# Altium schematic sheet Debug UART.SchDoc: Debug UART
size 431 x 279 mm; CheckedBy: Lance Bantoto; Engineer: Chealsie Bains; DocumentNumber: 22; Revision: 1; SheetNumber: 22; SheetTotal: 23
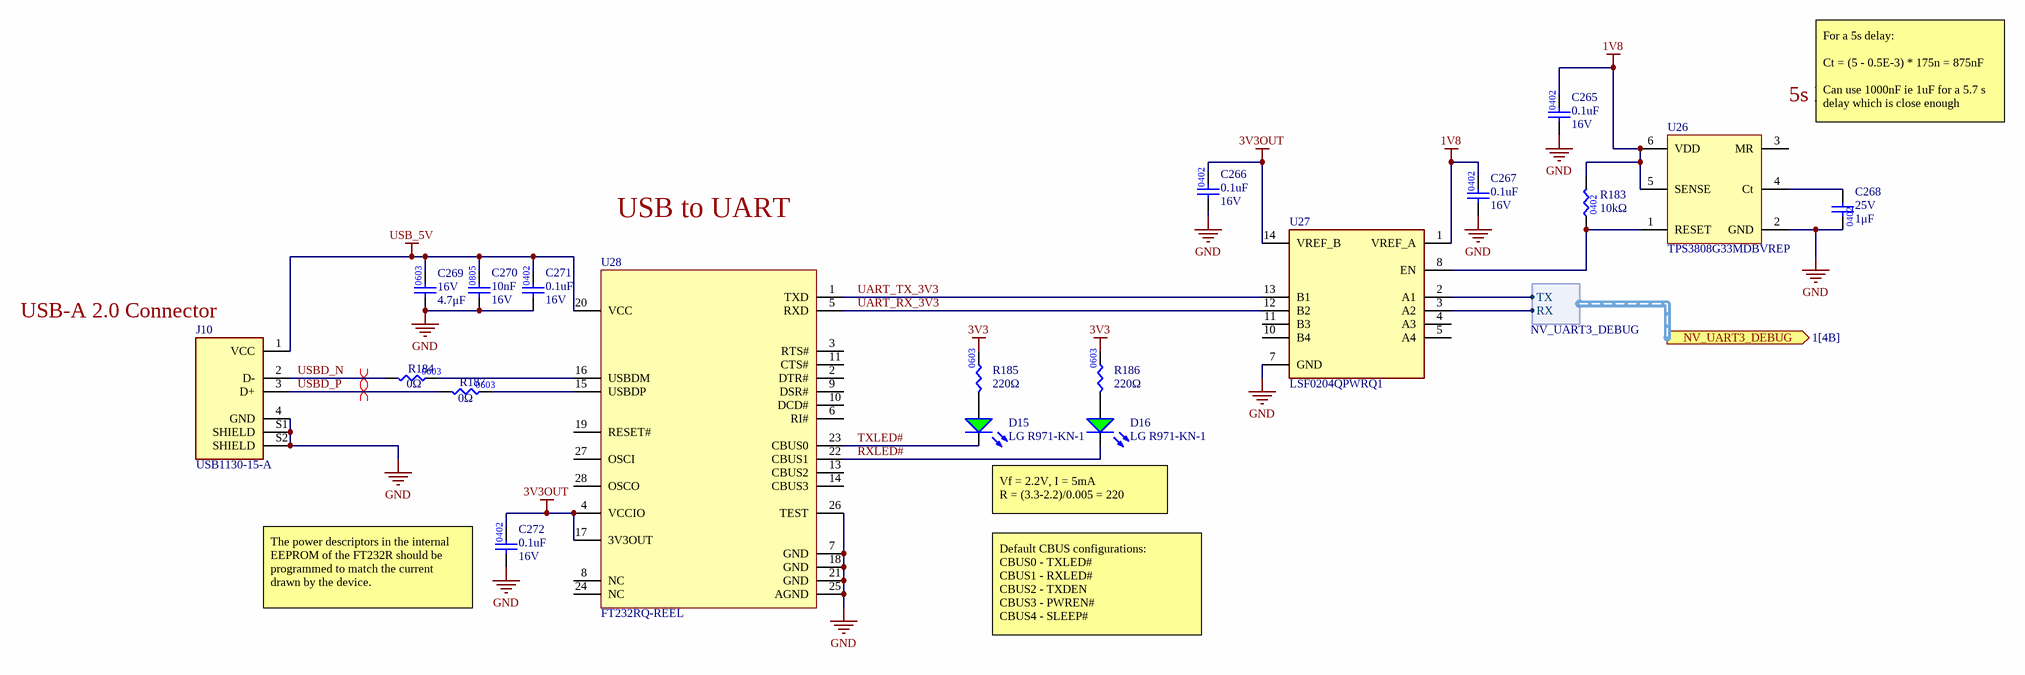
[diagram p0: Debug UART.SchDoc]

## Parts
C265  Capacitance: 0.1uF  Voltage Rating: 16V  [CAP0402]  (hidden comment: CAP_0.1uF_16V_X7R_0402)
C266  Capacitance: 0.1uF  Voltage Rating: 16V  [CAP0402]  (hidden comment: CAP_0.1uF_16V_X7R_0402)
C267  Capacitance: 0.1uF  Voltage Rating: 16V  [CAP0402]  (hidden comment: CAP_0.1uF_16V_X7R_0402)
C268  value 1μF  Voltage: 25V  [CAP0402]  (hidden comment: CAP_1uF_25V_0402)
C269  value 4.7μF  Voltage Rating: 16V  [CAP0603]  (hidden comment: CAP_4.7uF_16V_0603)
C270  value 10nF  Voltage Rating: 16V  [CAP2012]  (hidden comment: CAP_10nF_16V_0805)
C271  Capacitance: 0.1uF  Voltage Rating: 16V  [CAP0402]  (hidden comment: CAP_0.1uF_16V_X7R_0402)
C272  Capacitance: 0.1uF  Voltage Rating: 16V  [CAP0402]  (hidden comment: CAP_0.1uF_16V_X7R_0402)
D15  Manufacturer Part Number 1: LG R971-KN-1  [LED_0805_GREEN]  (hidden comment: LED_GREEN)
D16  Manufacturer Part Number 1: LG R971-KN-1  [LED_0805_GREEN]  (hidden comment: LED_GREEN)
J10  Manufacturer Part Number 1: USB1130-15-A  [USB-A 2.0 Connector]  (hidden comment: USB-A 2.0 Connector)
R183  Resistance: 10kΩ  [RES0402]  (hidden comment: RES_10kΩ_0402_1%)
R184  value 0Ω  [RES0603]  (hidden comment: RES_0Ω_0603)
R185  value 220Ω  [RES0603]  (hidden comment: RES_220Ω_0603)
R186  value 220Ω  [RES0603]  (hidden comment: RES_220Ω_0603)
R187  value 0Ω  [RES0603]  (hidden comment: RES_0Ω_0603)
U26  TPS3808G33MDBVREP  [TPS3808G33MDBVREP]
U27  LSF0204QPWRQ1  [SOP65P640X120-14N]
U28  FT232RQ-REEL  [FT232RQ-REEL_FTD]

## Ports
NV_UART3_DEBUG (out, harness NV_UART3_DEBUG, see 1[4B])

## Harnesses
NV_UART3_DEBUG: RX, TX

## Nets
1V8: C265.2 C267.2 R183.2 U26.5(SENSE) U26.6(VDD) U27.1(VREF_A)
3V3: R185.2 R186.2
3V3OUT: C266.2 C272.2 U27.14(VREF_B) U28.4(VCCIO) U28.17(3V3OUT)
GND: C265.1 C266.1 C267.1 C268.1 C269.1 C270.1 C271.1 C272.1 J10.4(GND) J10.S1(SHIELD) J10.S2(SHIELD) U26.2(GND) U27.7(GND) U28.7(GND) U28.18(GND) U28.21(GND) U28.25(AGND) U28.26(TEST)
USB_5V: C269.2 C270.2 C271.2 J10.1(VCC) U28.20(VCC)
RXLED#: D16.2(K) U28.22(CBUS1)
TXLED#: D15.2(K) U28.23(CBUS0)
UART_RX_3V3: U27.12(B2) U28.5(RXD)
UART_TX_3V3: U27.13(B1) U28.1(TXD)
USBD_N: J10.2(D-) R184.1
USBD_P: J10.3(D+) R187.1
NetC268_2: C268.2 U26.4(Ct)
NetD15_1: D15.1(A) R185.1
NetD16_1: D16.1(A) R186.1
NetR183_1: R183.1 U26.1(RESET) U27.8(EN)
NetR184_2: R184.2 U28.16(USBDM)
NetR187_2: R187.2 U28.15(USBDP)
NetU27_2: U27.2(A1) ; port NV_UART3_DEBUG.TX
NetU27_3: U27.3(A2) ; port NV_UART3_DEBUG.RX

Not connected (* = marked no-connect by the designer): U26 3(MR); U27 4(A3) 5(A4) 10(B4) 11(B3); U28 2(DTR#) 3(RTS#) 6(RI#) 8(NC) 9(DSR#) 10(DCD#) 11(CTS#) 13(CBUS2) 14(CBUS3) 19(RESET#) 24(NC) 27(OSCI) 28(OSCO)

## Layout directives
differential pair: USBD_N, USBD_P

## Notes on the sheet
- (near U26) 5s Delay Buffer
- For a 5s delay:
  Ct = (5 - 0.5E-3) * 175n = 875nF
  Can use 1000nF ie 1uF for a 5.7 s delay which is close enough
- USB to UART
- (near J10) USB-A 2.0 Connector
- Vf = 2.2V, I = 5mA
  R = (3.3-2.2)/0.005 = 220
- (near C272) The power descriptors in the internal EEPROM of the FT232R should be programmed to match the current
  drawn by the device.
- Default CBUS configurations:
  CBUS0 - TXLED#
  CBUS1 - RXLED#
  CBUS2 - TXDEN
  CBUS3 - PWREN#
  CBUS4 - SLEEP#
- University of Waterloo Robotics Team
- 200 University Ave W
- REV
- PROJECT
- Waterloo, Ontario, Canada
- N2L 3G1
- DOCUMENT
- ENGINEER
- REVIEWER
- MODIFIED
- SHEET
- OF
- (in symbol CAP_10nF_16V_0805) 0805

## Library data of the parts
C265-C267 C271 C272 = CAP_0.1uF_16V_X7R_0402: CAP CER 0.1UF 16V X7R 0402; Supplier 1: Digi-Key; Mounting Type: Surface Mount; Package: 0402
C268 = CAP_1uF_25V_0402: CAP CER 1UF 25V X5R 0402; Manufacturer 1: TDK Corporation; Manufacturer Part Number 1: C1005X5R1E105K050BE; Supplier 1: Digi-Key; Supplier Part Number 1: 445-175215-1-ND; Package: 0402
C269 = CAP_4.7uF_16V_0603: CAP CER 4.7UF 16V X6S 0603; Manufacturer Part Number 1: GRM188C81C475KE11D; Manufacturer 1: Murata Electronics; Supplier Part Number 1: 490-13362-1-ND; Supplier 1: Digi-Key; Mounting Type: SMD; Dielectric: X6S; Package: 0603
C270 = CAP_10nF_16V_0805: CAP CER 10000PF 16V X7R 0805; Manufacturer 1: Yageo; Manufacturer Part Number 1: AC0805KRX7R7BB103; Supplier 1: Digi-Key; Supplier Part Number 1: 311-3161-1-ND
D15 D16 = LED_GREEN: LED GREEN DIFFUSED 0805 SMD; Manufacturer 1: OSRAM; Forward Voltage Drop: 2.2V; Package/Footprint: 0805; Supplier Part Number 1: 475-1410-1-ND; Supplier 1: Digi-Key; Mounting Type: SMD
J10 = USB-A 2.0 Connector: USB-A (USB TYPE-A) USB 2.0 Receptacle Connector 4 Position Through Hole, Right Angle; Manufacturer 1: GCT; Supplier 1: Digi-Key; Supplier Part Number 1: 2073-USB1130-15-ACT-ND
R183 = RES_10kΩ_0402_1%: RES 10K OHM 1% 1/16W 0402; Manufacturer Part Number 1: RC1005F103CS; Manufacturer 1: Samsung Electro-Mechanics; Supplier 1: Digi-Key; Supplier Part Number 1: 1276-3431-1-ND; Tolerance: 1%; Package: 0402
R184 R187 = RES_0Ω_0603: RES 0 OHM JUMPER 1/10W 0603; Manufacturer 1: Yageo; Manufacturer Part Number 1: RC0603JR-070RL; Supplier Part Number 1: 311-0.0GRCT-ND; Supplier 1: Digi-Key; Mounting Type: SMD; Package: 0603
R185 R186 = RES_220Ω_0603_5%: RES 220 OHM 5% 1/10W 0603; Manufacturer 1: Yageo; Manufacturer Part Number 1: AC0603JR-07220RL; Package/Footprint: 0603; Supplier Part Number 1: YAG3652CT-ND; Supplier 1: Digi-Key
U26 = TPS3808G33MDBVREP: IC SUPERVISOR 1 CHANNEL SOT23-6; Manufacturer 1: Texas Instruments; Supplier 1: Digi-Key; Supplier Part Number 1: 296-23569-1-ND; Manufacturer Part Number 1: TPS3808G33MDBVREP
U27 = LSF0204QPWRQ1: 4-BITS MULTI-VOLTAGE LEVEL TRANS; Manufacturer 1: Texas Instruments; Channel Type: Bidirectional; Channels per Circuit: 4; Output Type: Open Drain, Push Pull; Data Rate: 100MBd; Voltage - VCCA: 0.8V - 4.5V; Voltage - VCCB: 1.8V - 5.5V; Manufacturer Part Number 1: LSF0204QPWRQ1; Supplier 1: Digi-Key; Supplier Part Number 1: 296-51425-1-ND; Package: 14-TSSOP
U28 = FT232RQ-REEL: USB Bridge, USB to UART USB 2.0 UART Interface 32-QFN (5x5); Manufacturer: FTDI; Max Frequency: 48MHz; Package Equivalence Code: LCC32,.2SQ,20; Max Supply Voltage: 5.25V; Min Supply Voltage: 3.3V; Max Supply Current: 100uA; Qualification Status: Not Qualified; Supplier 1: Digi-Key; Supplier Part Number 1: 768-1008-1-ND; RoHS: Yes; Category: Interface ICs; Pricing 1: 1=4.70000, 10=4.25000, 50=4.05000, 100=3.85000, 250=3.45000, 500=3.05000, 1000=2.85002, 2500=2.55001 (USD); Package Code: HVQCCN; Number of Pins: 32; Package Shape: Square; Min Operating Temperature: -40°C; Max Operating Temperature: 85°C; JESD-30 Code: S-XQCC-N32; Moisture Sensitivity Level: 3; Package Style: CHIP CARRIER, HEAT SINK/SLUG, VERY THIN PROFILEMeter; Surface Mount: Yes; Technology: CMOS; Terminal Form: No Lead; Terminal Position: QUAD; Length: 5mm; Width: 5mm; Height - Seated (Max): 1mm; Terminal Pitch: 0.5mm; Temperature Grade: INDUSTRIAL; REACH SVHC: Yes; RoHS Compliant: Yes; ComponentLink1URL: https://datasheet.ciiva.com:443/pdfs/VipMasterIC/IC/FTDI/FTDI-S-A0007980421/FTDI-S-A0007980421-1.pdf?src-supplier=IHS+Markit; ComponentLink1Description: https://datasheet.ciiva.com:443/pdfs/VipMasterIC/IC/FTDI/FTDI-S-A0007980421/FTDI-S-A0007980421-1.pdf?src-supplier=IHS+Markit; ComponentLink2URL: https://datasheet.ciiva.com/1505/1647396-1505445.pdf?src-supplier=Digi-Key; ComponentLink2Description: https://datasheet.ciiva.com/1505/1647396-1505445.pdf?src-supplier=Digi-Key; ComponentLink3URL: https://datasheet.ciiva.com/26841/ft232rq-reel-26841082.pdf?src-supplier=IIIC; ComponentLink3Description: https://datasheet.ciiva.com/26841/ft232rq-reel-26841082.pdf?src-supplier=IIIC; ComponentLink4URL: https://datasheet.ciiva.com/16438/ds-ft232r-16438555.pdf?src-supplier=Future+Electronics; ComponentLink4Description: https://datasheet.ciiva.com/16438/ds-ft232r-16438555.pdf?src-supplier=Future+Electronics; ComponentLink5URL: https://datasheet.ciiva.com/15150/getdatasheetpartid-644721-15150509.pdf?src-supplier=Verical; ComponentLink5Description: https://datasheet.ciiva.com/15150/getdatasheetpartid-644721-15150509.pdf?src-supplier=Verical; ComponentLink6URL: https://datasheet.ciiva.com/4787/ds-ft232r-4787663.pdf?src-supplier=Mouser; ComponentLink6Description: https://datasheet.ciiva.com/4787/ds-ft232r-4787663.pdf?src-supplier=Mouser; ComponentLink7URL: https://datasheet.ciiva.com/1787/ds-ft232r-1787041.pdf?src-supplier=Digi-Key; ComponentLink7Description: https://datasheet.ciiva.com/1787/ds-ft232r-1787041.pdf?src-supplier=Digi-Key; ComponentLink8URL: https://datasheet.ciiva.com/1787/ds-ft232r-1787042.pdf?src-supplier=Digi-Key; ComponentLink8Description: https://datasheet.ciiva.com/1787/ds-ft232r-1787042.pdf?src-supplier=Digi-Key; Manufacturer Part Number: FT232RQ-REEL